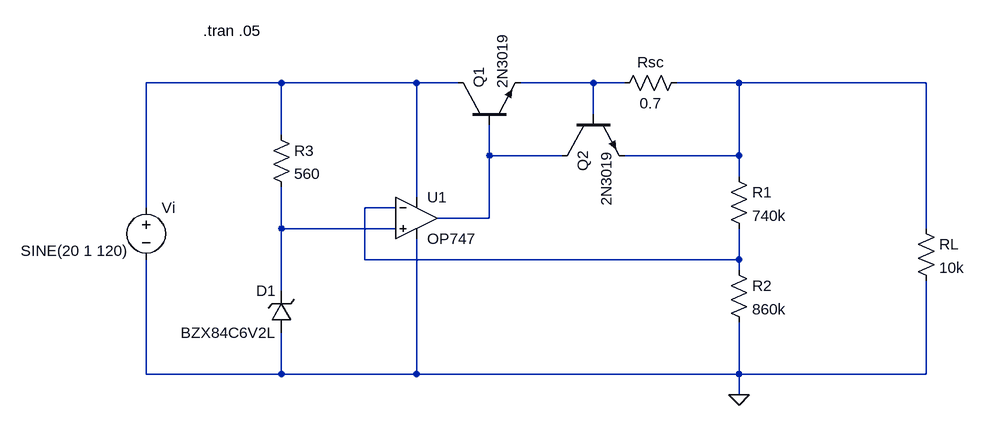
[diagram p0: schematic REGULADORES - Fonte Regulada 1 - AmpOp.asc]
REGULADORES - Fonte Regulada 1 - AmpOp.asc, the LTspice schematic file:
Version 4
SHEET 1 880 680
WIRE -336 -48 -544 -48
WIRE -128 -48 -336 -48
WIRE -64 -48 -128 -48
WIRE 144 -48 32 -48
WIRE 192 -48 144 -48
WIRE 368 -48 272 -48
WIRE 656 -48 368 -48
WIRE 144 0 144 -48
WIRE -336 32 -336 -48
WIRE -16 64 -16 16
WIRE 96 64 -16 64
WIRE 368 64 368 -48
WIRE 368 64 192 64
WIRE 368 96 368 64
WIRE -128 128 -128 -48
WIRE -544 144 -544 -48
WIRE -160 144 -208 144
WIRE -16 160 -16 64
WIRE -16 160 -96 160
WIRE -336 176 -336 112
WIRE -160 176 -336 176
WIRE 656 176 656 -48
WIRE -208 224 -208 144
WIRE 368 224 368 176
WIRE 368 224 -208 224
WIRE 368 240 368 224
WIRE -336 272 -336 176
WIRE -544 400 -544 224
WIRE -336 400 -336 336
WIRE -336 400 -544 400
WIRE -128 400 -128 192
WIRE -128 400 -336 400
WIRE 368 400 368 320
WIRE 368 400 -128 400
WIRE 656 400 656 256
WIRE 656 400 368 400
WIRE 368 432 368 400
FLAG 368 432 0
SYMBOL res 352 80 R0
SYMATTR InstName R1
SYMATTR Value 740k
SYMBOL res 352 224 R0
SYMATTR InstName R2
SYMATTR Value 860k
SYMBOL res -352 16 R0
SYMATTR InstName R3
SYMATTR Value 560
SYMBOL res 640 160 R0
SYMATTR InstName RL
SYMATTR Value 10k
SYMBOL zener -320 336 R180
WINDOW 0 24 64 Left 2
WINDOW 3 24 0 Left 2
SYMATTR InstName D1
SYMATTR Value BZX84C6V2L
SYMBOL npn -64 16 R270
SYMATTR InstName Q1
SYMATTR Value 2N3019
SYMBOL voltage -544 128 R0
WINDOW 3 -193 82 Left 2
WINDOW 123 -114 119 Left 2
WINDOW 39 0 0 Left 2
SYMATTR Value SINE(20 1 120)
SYMATTR InstName Vi
SYMBOL Opamps\\OP747 -128 96 R0
SYMATTR InstName U1
SYMBOL res 288 -64 R90
WINDOW 0 0 56 VBottom 2
WINDOW 3 32 56 VTop 2
SYMATTR InstName Rsc
SYMATTR Value 0.7
SYMBOL npn 96 0 M90
SYMATTR InstName Q2
SYMATTR Value 2N3019
TEXT -456 -128 Left 2 !.tran .05

The netlist it stands for:
* REGULADORES - Fonte Regulada 1 - AmpOp.asc
R1 N003 N005 740k
R2 N005 0 860k
R3 N001 N006 560
RL N003 0 10k
D1 0 N006 BZX84C6V2L
Q1 N001 N004 N002 0 2N3019
Vi N001 0 SINE(20 1 120)
XU1 N006 N005 N001 0 N004 OP747  ; pins In+ In- V+ V- OUT
Rsc N003 N002 0.7
Q2 N004 N002 N003 0 2N3019
.model D D
.lib standard.dio
.model NPN NPN
.model PNP PNP
.lib standard.bjt
.tran .05
.backanno
.end